# EAGLE schematic Master_Micro_Circuit (EAGLE 9.3.0)
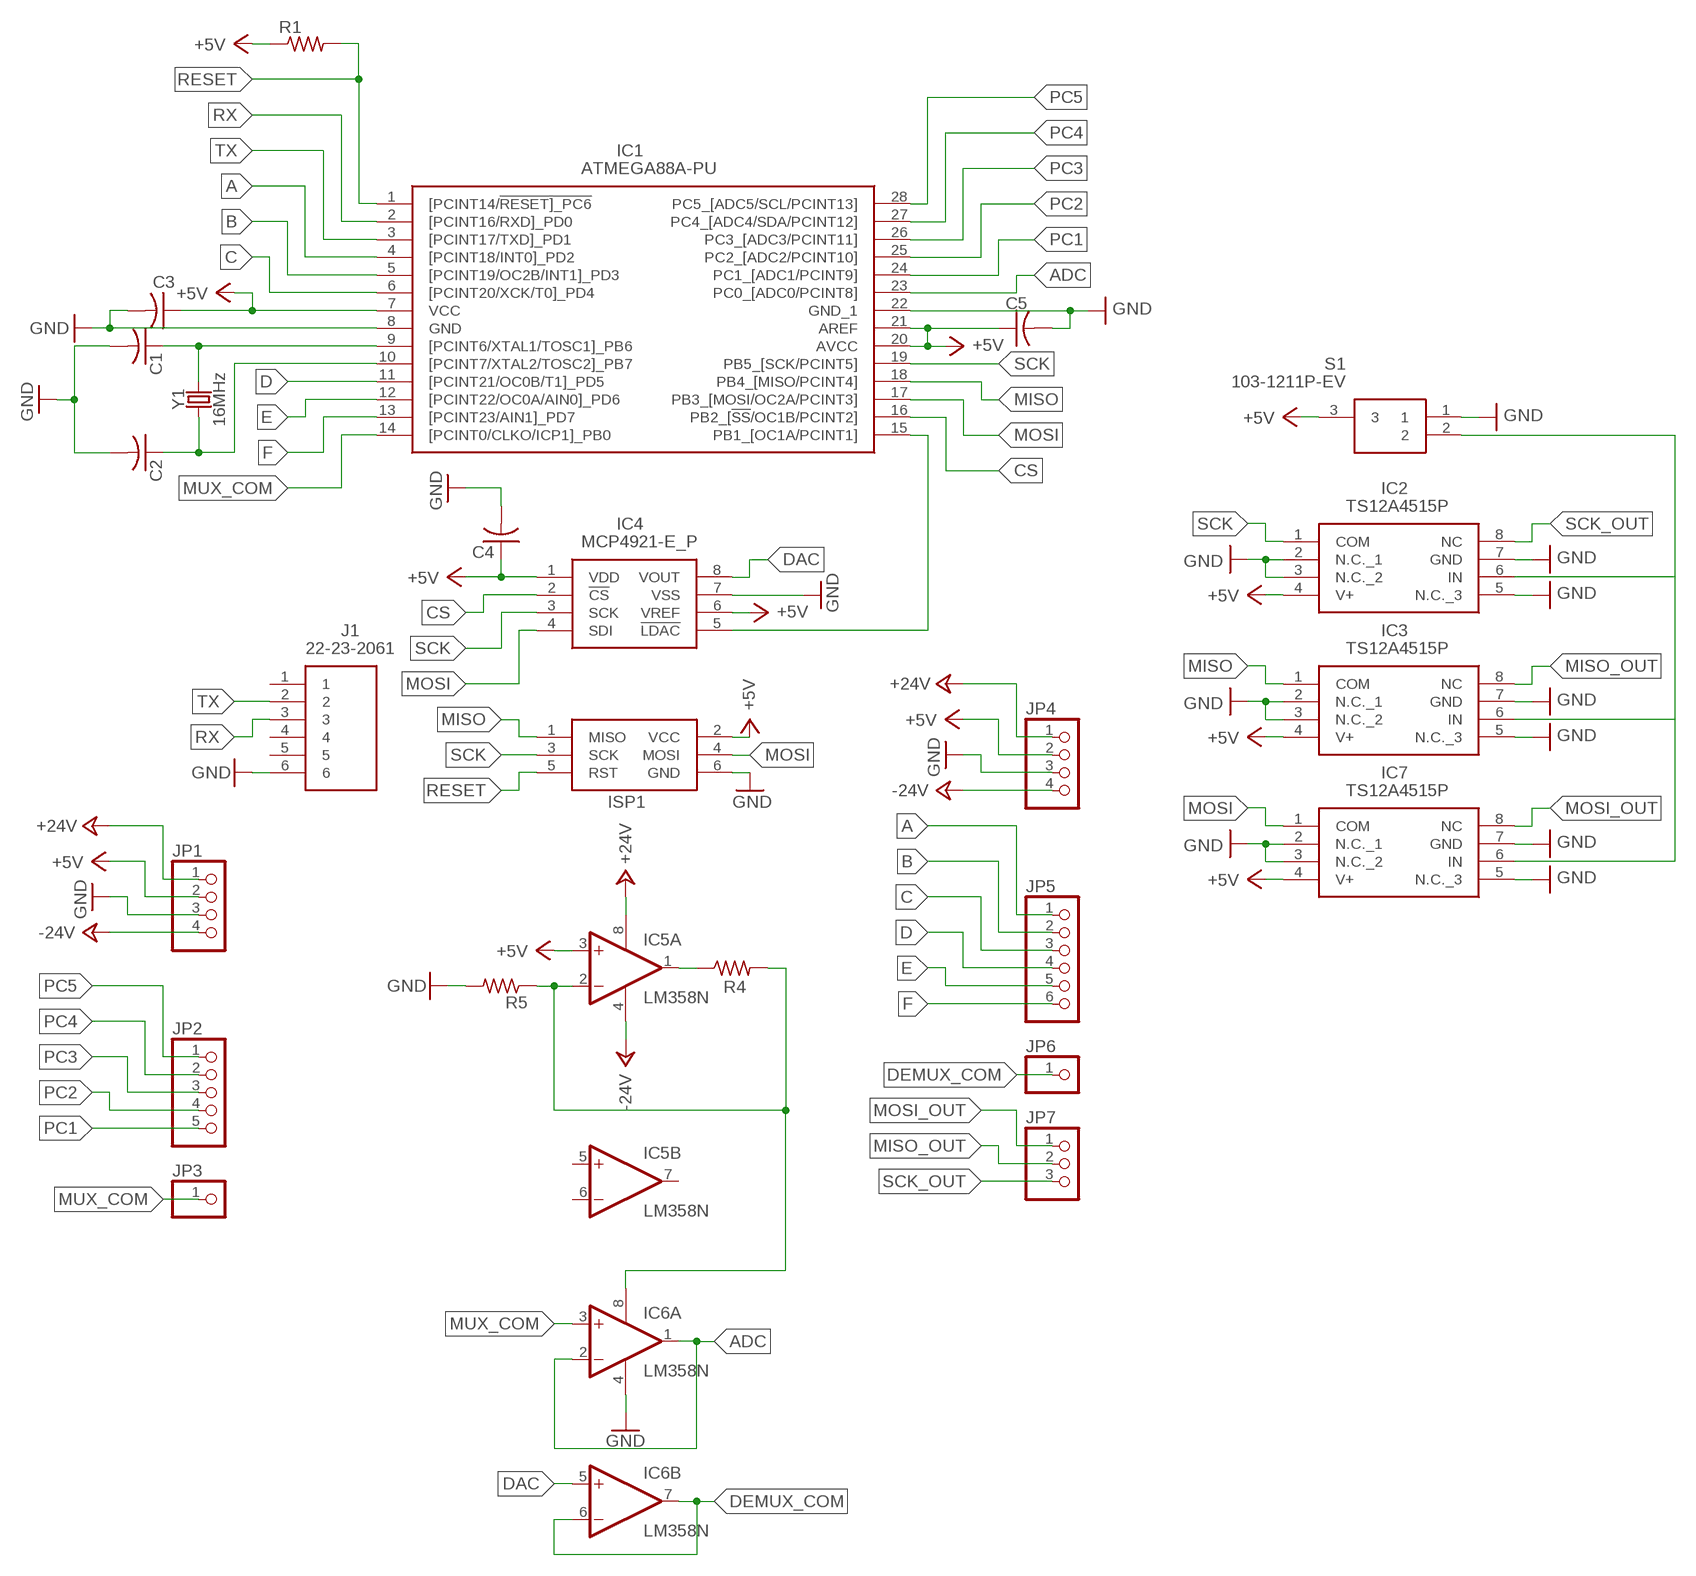
[diagram p0: schematic, sheet 1]

## Parts
C1  C-US050-030X075  [C050-030X075]
C2  C-US050-030X075  [C050-030X075]
C3  C-US050-030X075  [C050-030X075]
C4  C-US050-030X075  [C050-030X075]
C5  C-US050-030X075  [C050-030X075]
IC1  ATMEGA88A-PU  [DIP794W53P254L3467H457Q28N]
IC2  TS12A4515P  [DIP794W46P254L959H508Q8N]
IC3  TS12A4515P  [DIP794W46P254L959H508Q8N]
IC4  MCP4921-E_P  [DIP781W56P254L950H533Q8N]
IC5  LM358N  [DIL08]
IC6  LM358N  [DIL08]
IC7  TS12A4515P  [DIP794W46P254L959H508Q8N]
ISP1  AVRISP-BOX  [AVRISP-BOX]
J1  22-23-2061  [SHDR6W87P0X254_1X6_1509X635X10]
JP1  PINHD-1X4  [1X04]
JP2  PINHD-1X5  [1X05]
JP3  PINHD-1X1  [1X01]
JP4  PINHD-1X4  [1X04]
JP5  PINHD-1X6  [1X06]
JP6  PINHD-1X1  [1X01]
JP7  PINHD-1X3  [1X03]
R1  R-US_0207/10  [0207/10]
R4  R-US_0207/10  [0207/10]
R5  R-US_0207/10  [0207/10]
S1  103-1211P-EV  [1031211PEV]
Y1  16MHz  CRYSTAL-16MHZPTH-HC49US  [HC49US]

## Nets
+5V: C3.1 C4.1 C5.1 IC1.7(VCC) IC1.20(AVCC) IC1.21(AREF) IC2.4(V+) IC3.4(V+) IC4.1(VDD) IC4.6(VREF) IC5.3(A:+IN) IC7.4(V+) ISP1.2(VCC) JP1.2 JP4.2 R1.1 S1.3
+24V: IC5.8(P:V+) JP1.1 JP4.1
-24V: IC5.4(P:V-) JP1.4 JP4.4
A: IC1.4([PCINT18/INT0]_PD2) JP5.1
ADC: IC1.23(PC0_[ADC0/PCINT8]) IC6.1(A:OUT) IC6.2(A:-IN)
B: IC1.5([PCINT19/OC2B/INT1]_PD3) JP5.2
C: IC1.6([PCINT20/XCK/T0]_PD4) JP5.3
CS: IC1.16(PB2_[!SS!/OC1B/PCINT2]) IC4.2(!CS)
D: IC1.11([PCINT21/OC0B/T1]_PD5) JP5.4
DAC: IC4.8(VOUT) IC6.5(B:+IN)
DEMUX_COM: IC6.6(B:-IN) IC6.7(B:OUT) JP6.1
E: IC1.12([PCINT22/OC0A/AIN0]_PD6) JP5.5
F: IC1.13([PCINT23/AIN1]_PD7) JP5.6
GND: C1.2 C2.2 C3.2 C4.2 C5.2 IC1.8(GND) IC1.22(GND_1) IC2.2(N.C._1) IC2.3(N.C._2) IC2.5(N.C._3) IC2.7(GND) IC3.2(N.C._1) IC3.3(N.C._2) IC3.5(N.C._3) IC3.7(GND) IC4.7(VSS) IC6.4(P:V-) IC7.2(N.C._1) IC7.3(N.C._2) IC7.5(N.C._3) IC7.7(GND) ISP1.6(GND) J1.6 JP1.3 JP4.3 R5.2 S1.1
MISO: IC1.18(PB4_[MISO/PCINT4]) IC3.1(COM) ISP1.1(MISO)
MISO_OUT: IC3.8(NC) JP7.2
MOSI: IC1.17(PB3_[MOSI/OC2A/PCINT3]) IC4.4(SDI) IC7.1(COM) ISP1.4(MOSI)
MOSI_OUT: IC7.8(NC) JP7.1
MUX_COM: IC1.14([PCINT0/CLKO/ICP1]_PB0) IC6.3(A:+IN) JP3.1
N$1: C2.1 IC1.10([PCINT7/XTAL2/TOSC2]_PB7) Y1.1
N$2: IC5.1(A:OUT) R4.1
N$3: IC2.6(IN) IC3.6(IN) IC7.6(IN) S1.2
N$4: IC5.2(A:-IN) IC6.8(P:V+) R4.2 R5.1
N$5: IC1.15(PB1_[OC1A/PCINT1]) IC4.5(!LDAC)
N$11: C1.1 IC1.9([PCINT6/XTAL1/TOSC1]_PB6) Y1.2
PC1: IC1.24(PC1_[ADC1/PCINT9]) JP2.5
PC2: IC1.25(PC2_[ADC2/PCINT10]) JP2.4
PC3: IC1.26(PC3_[ADC3/PCINT11]) JP2.3
PC4: IC1.27(PC4_[ADC4/SDA/PCINT12]) JP2.2
PC5: IC1.28(PC5_[ADC5/SCL/PCINT13]) JP2.1
RESET: IC1.1([PCINT14/!RESET]_PC6) ISP1.5(RST) R1.2
RX: IC1.2([PCINT16/RXD]_PD0) J1.3
SCK: IC1.19(PB5_[SCK/PCINT5]) IC2.1(COM) IC4.3(SCK) ISP1.3(SCK)
SCK_OUT: IC2.8(NC) JP7.3
TX: IC1.3([PCINT17/TXD]_PD1) J1.2
Unconnected: IC5.5(B:+IN) IC5.6(B:-IN) IC5.7(B:OUT) J1.1 J1.4 J1.5

## Library data of the parts
C1-C5 = adafruit:C-US: CAPACITOR, American symbol
IC1 = SamacSys_Parts:ATMEGA88A-PU: ATMEGA88A-PU, 8 bit AVR Microcontroller 20MHz 512 B, 8 kB Flash, 1 kB RAM, I2C 28-Pin PDIP Source: Datasheet <https://componentsearchengine.com/Datasheets/1/ATMEGA88A-PU.pdf>; DESCRIPTION: ATMEGA88A-PU, 8 bit AVR Microcontroller 20MHz 512 B, 8 kB Flash, 1 kB RAM, I2C 28-Pin PDIP; HEIGHT: 4.572mm; MANUFACTURER_NAME: Microchip; MANUFACTURER_PART_NUMBER: ATMEGA88A-PU; MOUSER_PART_NUMBER: 556-ATMEGA88A-PU
IC2 IC3 IC7 = SamacSys_Parts:TS12A4515P: Low-Voltage, Low On-State Resistance SPST CMOS Analog Switches Source: Datasheet <http://www.ti.com/lit/ds/symlink/ts12a4515.pdf>; DESCRIPTION: Low-Voltage, Low On-State Resistance SPST CMOS Analog Switches; HEIGHT: 5.08mm; MANUFACTURER_NAME: Texas Instruments; MANUFACTURER_PART_NUMBER: TS12A4515P
IC4 = SamacSys_Parts:MCP4921-E_P: Microchip MCP4921-E/P, 12 bit Serial DAC, 8-Pin PDIP Source: Datasheet <https://componentsearchengine.com/Datasheets/1/MCP4921-E_P.pdf>; DESCRIPTION: Microchip MCP4921-E/P, 12 bit Serial DAC, 8-Pin PDIP; HEIGHT: 5.334mm; MANUFACTURER_NAME: Microchip; MANUFACTURER_PART_NUMBER: MCP4921-E/P; MOUSER_PART_NUMBER: 579-MCP4921-E/P
IC5 IC6 = linear:LM358: OP AMP also LM158; LM258; LM2904 Source: http://cache.national.com/ds/LM/LM158.pdf
ISP1 = adafruit:AVRISP: AVR ISP HEADER Standard 6 pin header for AVR programming
J1 = SamacSys_Parts:22-23-2061: 2.54mm,header,KK,vert,Sn,frictn lock,6w Molex KK 254 Series, Series Number 6373, 2.54mm Pitch 6 Way 1 Row Straight PCB Header, Through Hole, Solder Termination Source: Datasheet <https://componentsearchengine.com/Datasheets/1/22-23-2061.pdf>; DESCRIPTION: 2.54mm,header,KK,vert,Sn,frictn lock,6w Molex KK 254 Series, Series Number 6373, 2.54mm Pitch 6 Way 1 Row Straight PCB Header, Through Hole, Solder Termination; HEIGHT: 10.67mm; MANUFACTURER_NAME: Molex; MANUFACTURER_PART_NUMBER: 22-23-2061; MOUSER_PART_NUMBER: 538-22-23-2061
JP1 JP4 = pinhead:PINHD-1X4: PIN HEADER
JP2 = pinhead:PINHD-1X5: PIN HEADER
JP3 JP6 = pinhead:PINHD-1X1: PIN HEADER
JP5 = pinhead:PINHD-1X6: PIN HEADER
JP7 = pinhead:PINHD-1X3: PIN HEADER
R1 R4 R5 = rcl:R-US_: RESISTOR, American symbol; SPICEPREFIX: R
S1 = SamacSys_Parts:103-1211P-EV: Slide Switches SPDT 0.5A 50VDC Source: Datasheet <https://componentsearchengine.com/Datasheets/1/103-1211P-EV.pdf>; DESCRIPTION: Slide Switches SPDT 0.5A 50VDC; HEIGHT: 11mm; MANUFACTURER_NAME: Mountain Switch; MANUFACTURER_PART_NUMBER: 103-1211P-EV; MOUSER_PART_NUMBER: 103-1211P-EV; MOUSER_PRICE-STOCK: https://www.mouser.com/Search/Refine.aspx?Keyword=103-1211P-EV
Y1 = SparkFun-Clocks:CRYSTAL-16MHZ: 16MHz Crystal Digikey Example <http://www.digikey.com/product-search/en?keywords=535-9122-1-ND> Frequency: 16MHz Frequency Stability: ±50ppm Frequency Tolerance: ±20ppm Load Capacitance: 18pF SparkFun Products: Pro Micro -5V/16MHz <https://www.sparkfun.com/products/12640> SparkFun Serial Enabled LCD Kit <https://www.sparkfun.com/products/10097>; PROD_ID: XTAL-08181; SF_ID: COM-00536

## Net classes
0 default: width 0.305 mm, drill 0.508 mm, clearance 0.254 mm